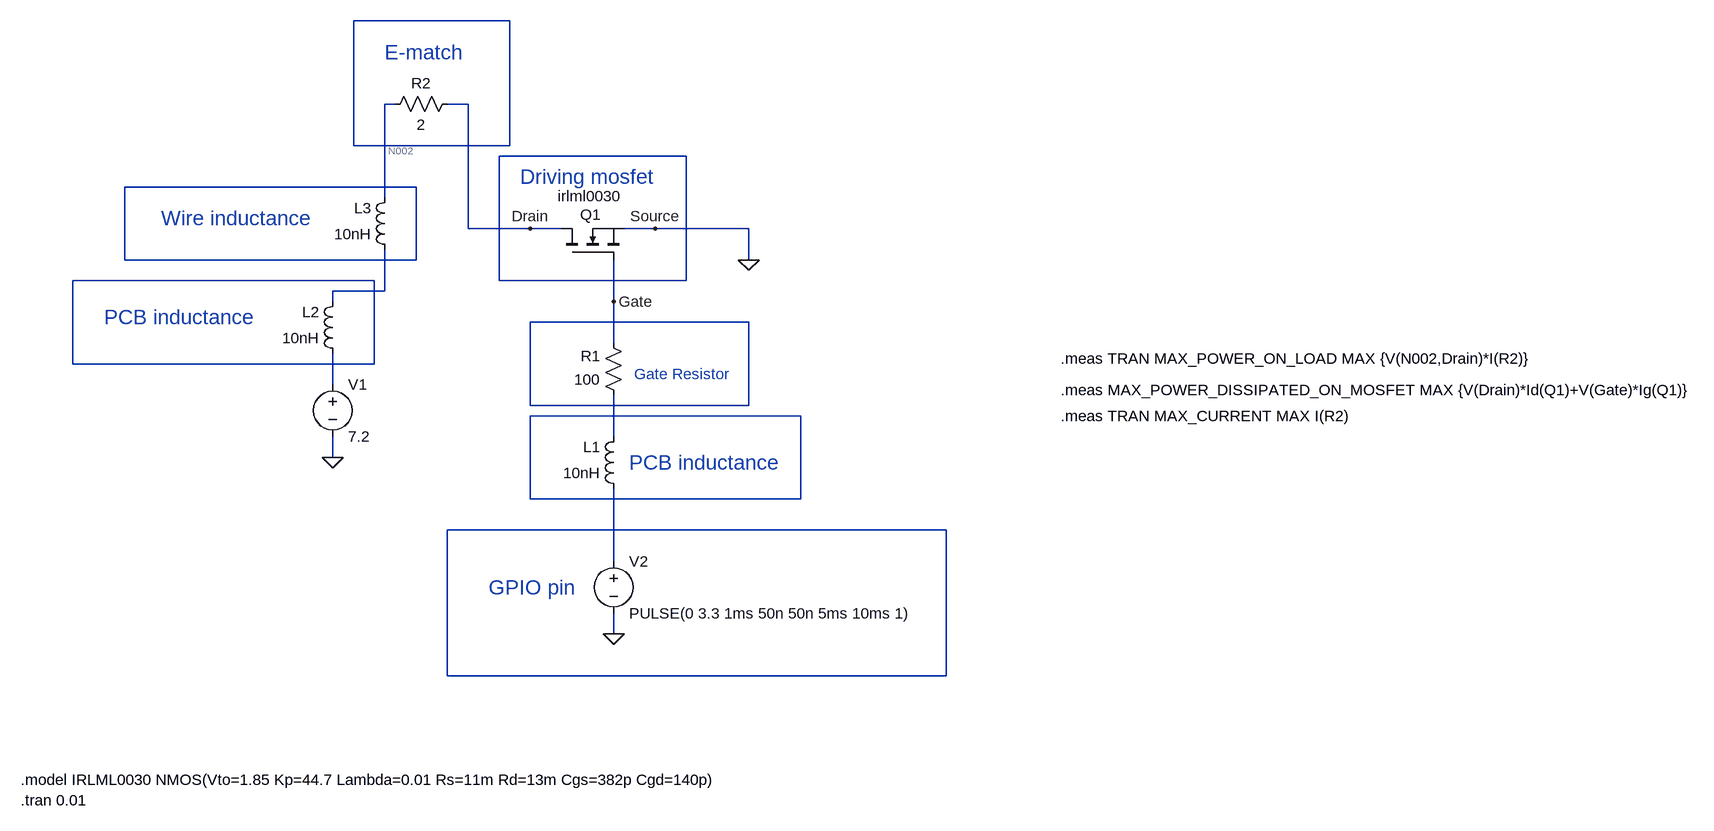
[diagram p0: schematic Draft3.asc]
Draft3.asc, the LTspice schematic file:
Version 4.1
SHEET 1 1956 800
WIRE 64 -416 -176 -416
WIRE -112 -288 -128 -288
WIRE 0 -288 -32 -288
WIRE -176 -224 -176 -416
WIRE 64 -224 64 -416
WIRE 64 -224 -176 -224
WIRE 336 -208 48 -208
WIRE -80 -160 -528 -160
WIRE -128 -144 -128 -288
WIRE 0 -96 0 -288
WIRE 96 -96 0 -96
WIRE 144 -96 96 -96
WIRE 288 -96 240 -96
WIRE 432 -96 288 -96
WIRE -528 -48 -528 -160
WIRE -80 -48 -80 -160
WIRE -80 -48 -528 -48
WIRE 432 -48 432 -96
WIRE -144 -16 -608 -16
WIRE 48 -16 48 -208
WIRE 336 -16 336 -208
WIRE 336 -16 48 -16
WIRE -128 0 -128 -64
WIRE -128 0 -208 0
WIRE -208 16 -208 0
WIRE 224 16 224 -48
WIRE 432 48 96 48
WIRE 224 80 224 16
WIRE -608 112 -608 -16
WIRE -144 112 -144 -16
WIRE -144 112 -608 112
WIRE -208 144 -208 96
WIRE 96 176 96 48
WIRE 432 176 432 48
WIRE 432 176 96 176
WIRE 512 192 96 192
WIRE 224 224 224 160
WIRE -208 256 -208 224
WIRE 96 320 96 192
WIRE 512 320 512 192
WIRE 512 320 96 320
WIRE 736 368 -32 368
WIRE 224 416 224 304
WIRE 224 528 224 496
WIRE -32 592 -32 368
WIRE 736 592 736 368
WIRE 736 592 -32 592
FLAG 224 528 0
FLAG -208 256 0
FLAG 432 -48 0
FLAG 96 -96 Drain
FLAG 224 16 Gate
FLAG 288 -96 Source
SYMBOL nmos 144 -48 R270
WINDOW 0 70 29 VRight 2
WINDOW 3 98 -6 VRight 2
SYMATTR InstName Q1
SYMATTR Value irlml0030
SYMBOL voltage -208 128 R0
WINDOW 123 0 0 Left 0
WINDOW 39 0 0 Left 0
SYMATTR InstName V1
SYMATTR Value 7.2
SYMBOL voltage 224 400 R0
WINDOW 123 0 0 Left 0
WINDOW 39 0 0 Left 0
SYMATTR InstName V2
SYMATTR Value PULSE(0 3.3 1ms 50n 50n 5ms 10ms 1)
SYMBOL res 240 176 R180
WINDOW 0 36 76 Left 2
WINDOW 3 36 40 Left 2
SYMATTR InstName R1
SYMATTR Value 100
SYMBOL ind -192 112 R180
WINDOW 0 36 80 Left 2
WINDOW 3 36 40 Left 2
SYMATTR InstName L2
SYMATTR Value 10nH
SYMATTR SpiceLine Ipk=5 Rser=20m Cpar=50pF
SYMBOL res -128 -272 R270
WINDOW 0 32 56 VTop 2
WINDOW 3 0 56 VBottom 2
SYMATTR InstName R2
SYMATTR Value 2
SYMBOL ind 240 320 R180
WINDOW 0 36 80 Left 2
WINDOW 3 36 40 Left 2
SYMATTR InstName L1
SYMATTR Value 10nH
SYMATTR SpiceLine Rser=20m Cpar=50pF
SYMBOL ind -112 -48 R180
WINDOW 0 36 80 Left 2
WINDOW 3 36 40 Left 2
SYMATTR InstName L3
SYMATTR Value 10nH
SYMATTR SpiceLine Ipk=5 Rser=20m Cpar=50pF
TEXT -688 752 Left 2 !.model IRLML0030 NMOS(Vto=1.85 Kp=44.7 Lambda=0.01 Rs=11m Rd=13m Cgs=382p Cgd=140p)
TEXT -688 784 Left 2 !.tran 0.01
TEXT 912 104 Left 2 !.meas TRAN MAX_POWER_ON_LOAD MAX {V(N002,Drain)*I(R2)}
TEXT 912 152 Left 2 !.meas MAX_POWER_DISSIPATED_ON_MOSFET MAX {V(Drain)*Id(Q1)+V(Gate)*Ig(Q1)}
TEXT 912 192 Left 2 !.meas TRAN MAX_CURRENT MAX I(R2)
TEXT -560 40 Left 3 ;PCB inductance
TEXT -472 -112 Left 3 ;Wire inductance
TEXT -128 -368 Left 3 ;E-match
TEXT 80 -176 Left 3 ;Driving mosfet
TEXT 248 264 Left 3 ;PCB inductance
TEXT 256 128 Left 2 ;Gate Resistor
TEXT 32 456 Left 3 ;GPIO pin

The netlist it stands for:
* Draft3.asc
M§Q1 Drain Gate 0 0 irlml0030
V1 N008 0 7.2
V2 N012 0 PULSE(0 3.3 1ms 50n 50n 5ms 10ms 1)
R1 N010 Gate 100
L2 N008 N006 10nH Ipk=5 Rser=20m Cpar=50pF
R2 N002 Drain 2
L1 N012 N010 10nH Rser=20m Cpar=50pF
L3 N006 N002 10nH Ipk=5 Rser=20m Cpar=50pF
.model NMOS NMOS
.model PMOS PMOS
.lib standard.mos
.model IRLML0030 NMOS(Vto=1.85 Kp=44.7 Lambda=0.01 Rs=11m Rd=13m Cgs=382p Cgd=140p)
.tran 0.01
.meas TRAN MAX_POWER_ON_LOAD MAX {V(N002,Drain)*I(R2)}
.meas MAX_POWER_DISSIPATED_ON_MOSFET MAX {V(Drain)*Id(Q1)+V(Gate)*Ig(Q1)}
.meas TRAN MAX_CURRENT MAX I(R2)
* PCB inductance
* Wire inductance
* E-match
* Driving mosfet
* PCB inductance
* Gate Resistor
* GPIO pin
.backanno
.end